# Altium schematic sheet debug.SchDoc
size A4
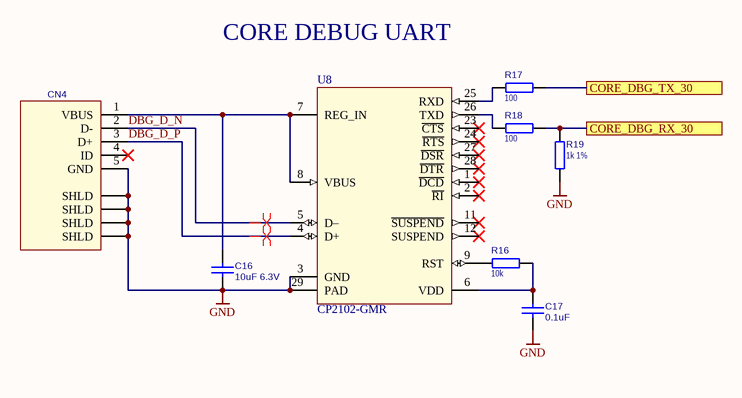
[diagram p0: debug.SchDoc]

## Parts
C16  value 10uF 6.3V  [C0603]  (hidden comment: CC0603MRX5R5BB106)
C17  value 0.1uF  [C0603]  (hidden comment: C1608X7R1H104K080AA)
CN4  USB Type-B mini  [USB-B_SMD-MICRO-01]  (value not drawn)
R16  10k  [R0603]
R17  100  [R0603]
R18  100  [R0603]
R19  1k 1%  [R0603]
U8  CP2102-GMR  [QFN-28-4x4]

## Ports
CORE_DBG_RX_30, CORE_DBG_TX_30

## Nets
GND: C16.2 C17.2 CN4.5(GND) CN4.6(SHLD) CN4.7(SHLD) CN4.8(SHLD) CN4.9(SHLD) R19.2 U8.3(GND) U8.29(PAD)
CORE_DBG_RX_30: R18.1 R19.1 ; port CORE_DBG_RX_30
CORE_DBG_TX_30: R17.1 ; port CORE_DBG_TX_30
DBG_D_N: CN4.2(D-) U8.5(D–)
DBG_D_P: CN4.3(D+) U8.4(D+)
NetC16_1: C16.1 CN4.1(VBUS) U8.7(REG_IN) U8.8(VBUS)
NetC17_1: C17.1 R16.1 U8.6(VDD)
NetR16_2: R16.2 U8.9(RST)
NetR17_2: R17.2 U8.25(RXD)
NetR18_2: R18.2 U8.26(TXD)

Not connected (* = marked no-connect by the designer): CN4 4(ID)* MH1 MH2; U8 1(~{DCD})* 2(~{RI})* 11(~{SUSPEND})* 12(SUSPEND)* 23(~{CTS})* 24(~{RTS})* 27(~{DSR})* 28(~{DTR})*

## Layout directives
differential pair: DBG_D_N, DBG_D_P

## Notes on the sheet
- CORE DEBUG UART

## Library data of the parts
C16 C17 = CAP_NPOL
CN4 = USB-B-M: Value: KLS1-229-5FD
R16-R19 = RESISTOR: RES
  R16: Value: 10k
  R17 R18: Value: 100
  R19: Value: 1k 1%
U8 = CP2102: SINGLE-CHIP USB-TO-UART BRIDGE; value: CP2102-GMR